# Altium schematic sheet Sheet1.SchDoc
size A; SheetNumber: 1; SheetTotal: 1; SPICEModelCacheLTMPAJCY: <root> / <DocumentId>LTMPAJCY</DocumentId> / <CacheFrame Number="0"> / <Model Name="led0" Kind="MDL"> / <Text>*Typ INFRARED GaAs LED: Vf=1.2V Vr=5V If=40mA trr=3uS / *LED Pinout: 1=A, 2=K / .MODEL LED0 D (IS=93.5P RS=84M N=2.63 BV=5 IBV=10U / + CJO=2.97P VJ=.75 M=.333 TT=4.32U)</Text> / </Model> / </CacheFrame> / </root>
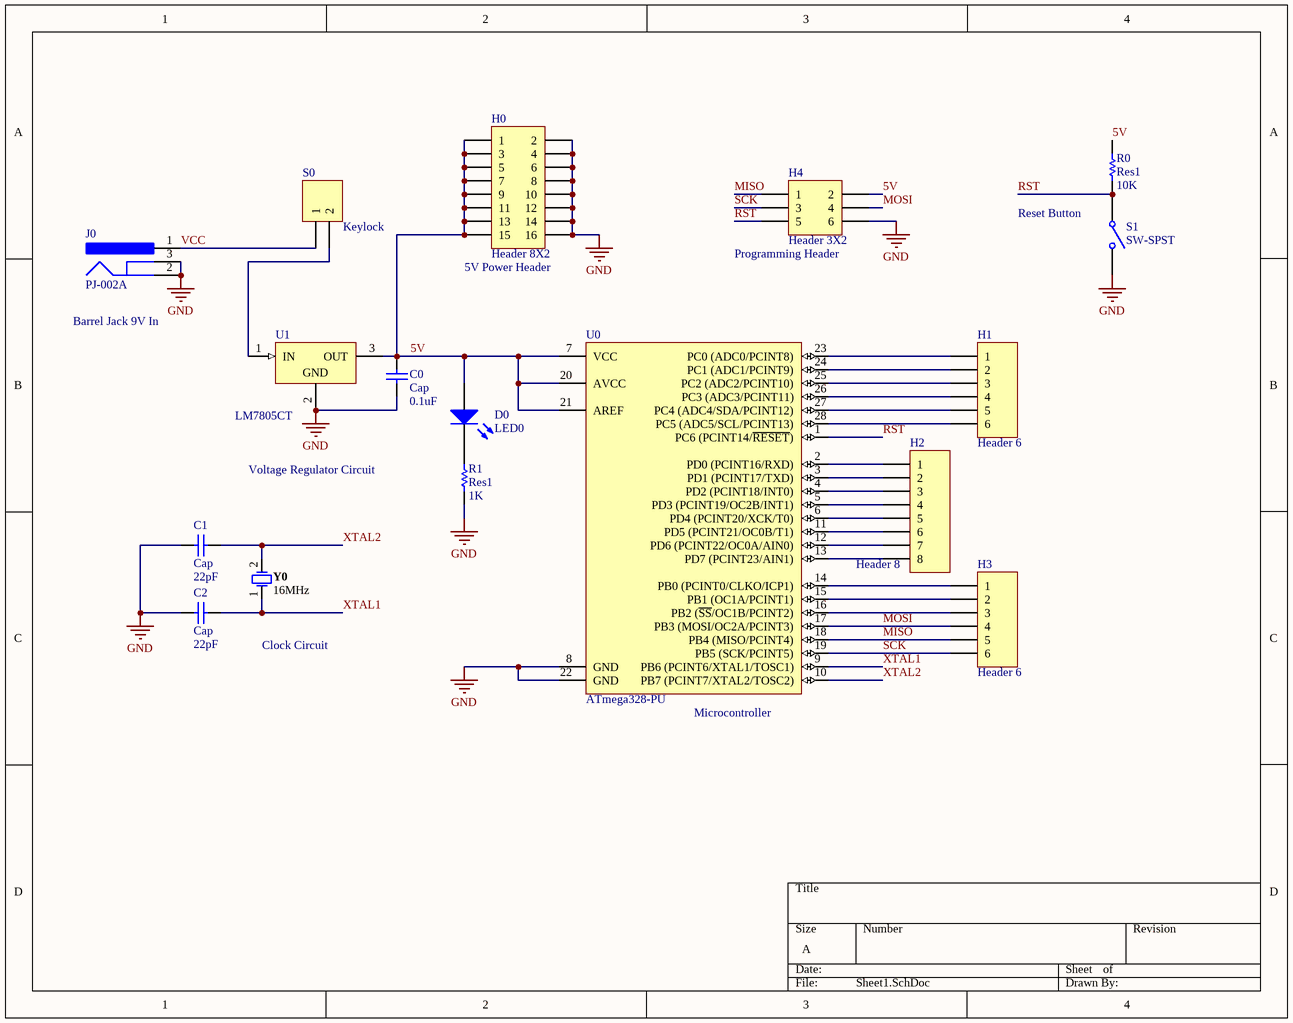
[diagram p0: Sheet1.SchDoc]

## Parts
C0  Cap  value 0.1uF  [RAD-0.3]
C1  Cap  value 22pF  [RAD-0.3]
C2  Cap  value 22pF  [RAD-0.3]
D0  LED0  [LED-0]
H0  Header 8X2  [HDR2X8]
H1  Header 6  [HDR1X6]
H2  Header 8  [HDR1X8]
H3  Header 6  [HDR1X6]
H4  Header 3X2  [HDR2X3]
J0  PJ-002A  [CUI-PJ-002A_V]
R0  Res1  value 10K  [AXIAL-0.5]
R1  Res1  value 1K  [AXIAL-0.5]
S0  Keylock  [HDR1X2]
S1  SW-SPST  [SPST-2]
U0  ATmega328-PU  [28P3]
U1  LM7805CT  [FAIR-TO-220-3]
Y0  16MHz  [FOX-FOXSLF160-20]

## Nets
GND: C0.1 C1.1 C2.1 H0.2 H0.4 H0.6 H0.8 H0.10 H0.12 H0.14 H0.16 H4.6 J0.2 J0.3 R1.1 S1.2(NO) U0.8(GND) U0.22(GND) U1.2(GND)
5V: C0.2 D0.1(A) H0.1 H0.3 H0.5 H0.7 H0.9 H0.11 H0.13 H0.15 H4.2 R0.2 U0.7(VCC) U0.20(AVCC) U0.21(AREF) U1.3(OUT)
MISO: H3.5 H4.1 U0.18(PB4_(MISO/PCINT4))
MOSI: H3.4 H4.4 U0.17(PB3_(MOSI/OC2A/PCINT3))
RST: H4.5 R0.1 S1.1(COMMON) U0.1(PC6_(PCINT14/~{RESET}))
SCK: H3.6 H4.3 U0.19(PB5_(SCK/PCINT5))
VCC: J0.1 S0.1
XTAL1: C2.2 U0.9(PB6_(PCINT6/XTAL1/TOSC1)) Y0.1
XTAL2: C1.2 U0.10(PB7_(PCINT7/XTAL2/TOSC2)) Y0.2
NetD0_2: D0.2(K) R1.2
NetH1_1: H1.1 U0.23(PC0_(ADC0/PCINT8))
NetH1_2: H1.2 U0.24(PC1_(ADC1/PCINT9))
NetH1_3: H1.3 U0.25(PC2_(ADC2/PCINT10))
NetH1_4: H1.4 U0.26(PC3_(ADC3/PCINT11))
NetH1_5: H1.5 U0.27(PC4_(ADC4/SDA/PCINT12))
NetH1_6: H1.6 U0.28(PC5_(ADC5/SCL/PCINT13))
NetH2_1: H2.1 U0.2(PD0_(PCINT16/RXD))
NetH2_2: H2.2 U0.3(PD1_(PCINT17/TXD))
NetH2_3: H2.3 U0.4(PD2_(PCINT18/INT0))
NetH2_4: H2.4 U0.5(PD3_(PCINT19/OC2B/INT1))
NetH2_5: H2.5 U0.6(PD4_(PCINT20/XCK/T0))
NetH2_6: H2.6 U0.11(PD5_(PCINT21/OC0B/T1))
NetH2_7: H2.7 U0.12(PD6_(PCINT22/OC0A/AIN0))
NetH2_8: H2.8 U0.13(PD7_(PCINT23/AIN1))
NetH3_1: H3.1 U0.14(PB0_(PCINT0/CLKO/ICP1))
NetH3_2: H3.2 U0.15(PB1_(OC1A/PCINT1))
NetH3_3: H3.3 U0.16(PB2_(~{SS}/OC1B/PCINT2))
NetS0_2: S0.2 U1.1(IN)

## Notes on the sheet
- Reset Button
- (near H0) 5V Power Header
- (near H4) Programming Header
- (near J0) Barrel Jack 9V In
- Voltage Regulator Circuit
- Clock Circuit
- (near U0) Microcontroller

## Library data of the parts
C0-C2 = Cap: Capacitor; Published: 8-Jun-2000; LatestRevisionDate: 17-Jul-2002; LatestRevisionNote: Re-released for DXP Platform.; PackageReference: RAD-0.3; Publisher: Altium Limited; PackageDescription: Radial Cap, Thru-Hole; 2 Leads; 0.3 in Pin Spacing
D0 = LED0: Typical INFRARED GaAs LED; Published: 8-Jun-2000; LatestRevisionDate: 08-Jul-2005; LatestRevisionNote: Mech Layer 1 removed.; PackageReference: LED-0; Publisher: Altium Limited; PackageDescription: LED; 2 Leads
H0 = Header 8X2: Header, 8-Pin, Dual row; LatestRevisionDate: 17-Jul-2002; LatestRevisionNote: Re-released for DXP Platform.; Publisher: Altium Limited
H1 H3 = Header 6: Header, 6-Pin; LatestRevisionDate: 17-Jul-2002; LatestRevisionNote: Re-released for DXP Platform.; Publisher: Altium Limited
H2 = Header 8: Header, 8-Pin; LatestRevisionDate: 17-Jul-2002; LatestRevisionNote: Re-released for DXP Platform.; Publisher: Altium Limited
H4 = Header 3X2: Header, 3-Pin, Dual row; LatestRevisionDate: 17-Jul-2002; LatestRevisionNote: Re-released for DXP Platform.; Publisher: Altium Limited
J0 = CMP-2000-06895-2: Through Hole Right Angle DC Power Jack, 2.5 A, 2 mm Center Pin, 3 Position, -25 to 85 degC, RoHS, Bulk; Manufacturer: CUIInc.; Brand: CUI; Inside Contact Diameter: 2mm; Voltage Rating: 24V; Outside Contact Diameter: 6.5mm; Current Rating: 2.5A; Insulation Resistance: 50MOhms; Contact Gender: Male; Connector Type: DCPowerJack; Datasheet Version: Rev. 1.03, 04/2016; Housing Material: PolybutyleneTerephthalate(PBT); Operating Temperature Range: -25Cto+85C; Termination Style: ThroughHole; Product Category: DCPowerConnectors; Mounting Technology: ThroughHole; Mounting Style: ThroughHole; Factory Pack Quantity: 500; Contact Plating: Nickel; Package Reference: PJ-002A; Mounting Angle: Right; Package Description: 3-Pin Through Hole Device, Body 14.4 x 9 mm, Height 11 mm; Flammability Rating: UL94V-0; Manufacturer URL: http://www.cui.com/; Product: Jacks; Contact Material: Copper; Datasheet URL: http://www.cui.com/product/resource/pj-002a.pdf; RoHS: True
R0 R1 = Res1: Resistor; Published: 8-Jun-2000; LatestRevisionDate: 17-Jul-2002; LatestRevisionNote: Re-released for DXP Platform.; PackageReference: AXIAL-0.3; Publisher: Altium Limited; PackageDescription: Axial Device, Thru-Hole; 2 Leads; 0.3 in Pin Spacing
S0 = Header 2: Header, 2-Pin; LatestRevisionDate: 17-Jul-2002; LatestRevisionNote: Re-released for DXP Platform.; Publisher: Altium Limited
S1 = SW-SPST: Single-Pole, Single-Throw Switch; Published: 24-Mar-1999; LatestRevisionDate: 17-Jul-2002; LatestRevisionNote: Re-released for DXP Platform.; PackageReference: SPST-2; Publisher: Altium Limited; PackageDescription: Switch; 2 Leads
U0 = CMP-0095-00015-2: 8-bit AVR Microcontroller, 32KB Flash, 1KB EEPROM, 2KB SRAM, 28-pin PDIP, Industrial Grade (-40°C to 85°C); ComponentLink3Description: ATmega48A/48PA/88A/88PA/168A/168PA/328/328P Summary; RevisionNote: DatasheetVersion updated. URLs added.; DatasheetVersion: revD, May-2011; ComponentLink1URL: http://www.atmel.com/; PackageVersion: revB, Sep-2001; PackageDescription: 28-lead (0.300"/7.62mm Wide) Plastic Dual Inline Package (PDIP); PackageReference: 28P3; ComponentLink1Description: Manufacturer URL; ComponentLink2Description: ATmega48A/48PA/88A/88PA/168A/168PA/328/328P Datasheet; ComponentLink3URL: http://www.atmel.com/dyn/resources/prod_documents/8271S.pdf; ComponentLink2URL: http://www.atmel.com/dyn/resources/prod_documents/8271.pdf
U1 = CMP-2000-04938-1: Positive Voltage Regulator, 5 V, 1 A, -40 to 125 degC, 3-Pin TO-220, RoHS, Tube; Manufacturer: FairchildSemiconductor; Maximum Input Voltage: 35V; Maximum Quiescent Current: 8mA; Load Regulation: 100mV; Maximum Output Current: 2.2(Typ)A; Output Type: Fixed; Typical Dropout Voltage @ Current: 2@1AV; Rad Hard: No; Output Voltage: 5V; Accuracy: ±4%; Number of Outputs: 1; Category: LinearRegulator; Package Description: 3-Pin Through Hole Device, Body 10 x 4.5 mm, Pitch 2.54 mm; Packaging: Rail/Tube; Mounting: ThroughHole; Polarity: Positive; Manufacturer URL: https://www.fairchildsemi.com/; Line Regulation: 100mV; Datasheet Version: Aug-12; Datasheet URL: https://datasheet.ciiva.com/26904/lm7805ct-26904988.pdf; Package Reference: TO-220; Package URL: https://www.fairchildsemi.com/package-drawings/TO/TO220B03.pdf; Package: 3TO-220AB; Operating Temperature: -40to125degC; Type: Linear
Y0 = CMP-1749-00003-1: Resistance Weld Thru-Hole Crystal, 16 MHz, -20 to 70 degC, 2-Pin THD, RoHS, Bulk; Voltage Rating: 250 V; Tolerance: 1%; Resistance: 221 kohm; Case\Package: Axial; Power Rating: 250 mW; RoHSCompliant: true; Package Quantity: 200; Packaging: Bulk; Min Operating Temperature: -55 degC; DatasheetVersion: Mar-15; ComponentLink1URL: http://www.foxonline.com/; Max Operating Temperature: 155 degC; PackageReference: FOXSLF160-20; Mount: Through Hole; PackageDescription: 2-Pin Through Hole Device, Body 11.35 x 4.65 mm; ComponentLink1Description: Manufacturer URL; ComponentLink2URL: http://www.foxonline.com/pdfs/hc49slf.pdf; ComponentLink2Description: Datasheet; Length: 0.248 inch